# Altium schematic sheet DA1.SchDoc
size A0; SheetNumber: 1; SheetTotal: 1
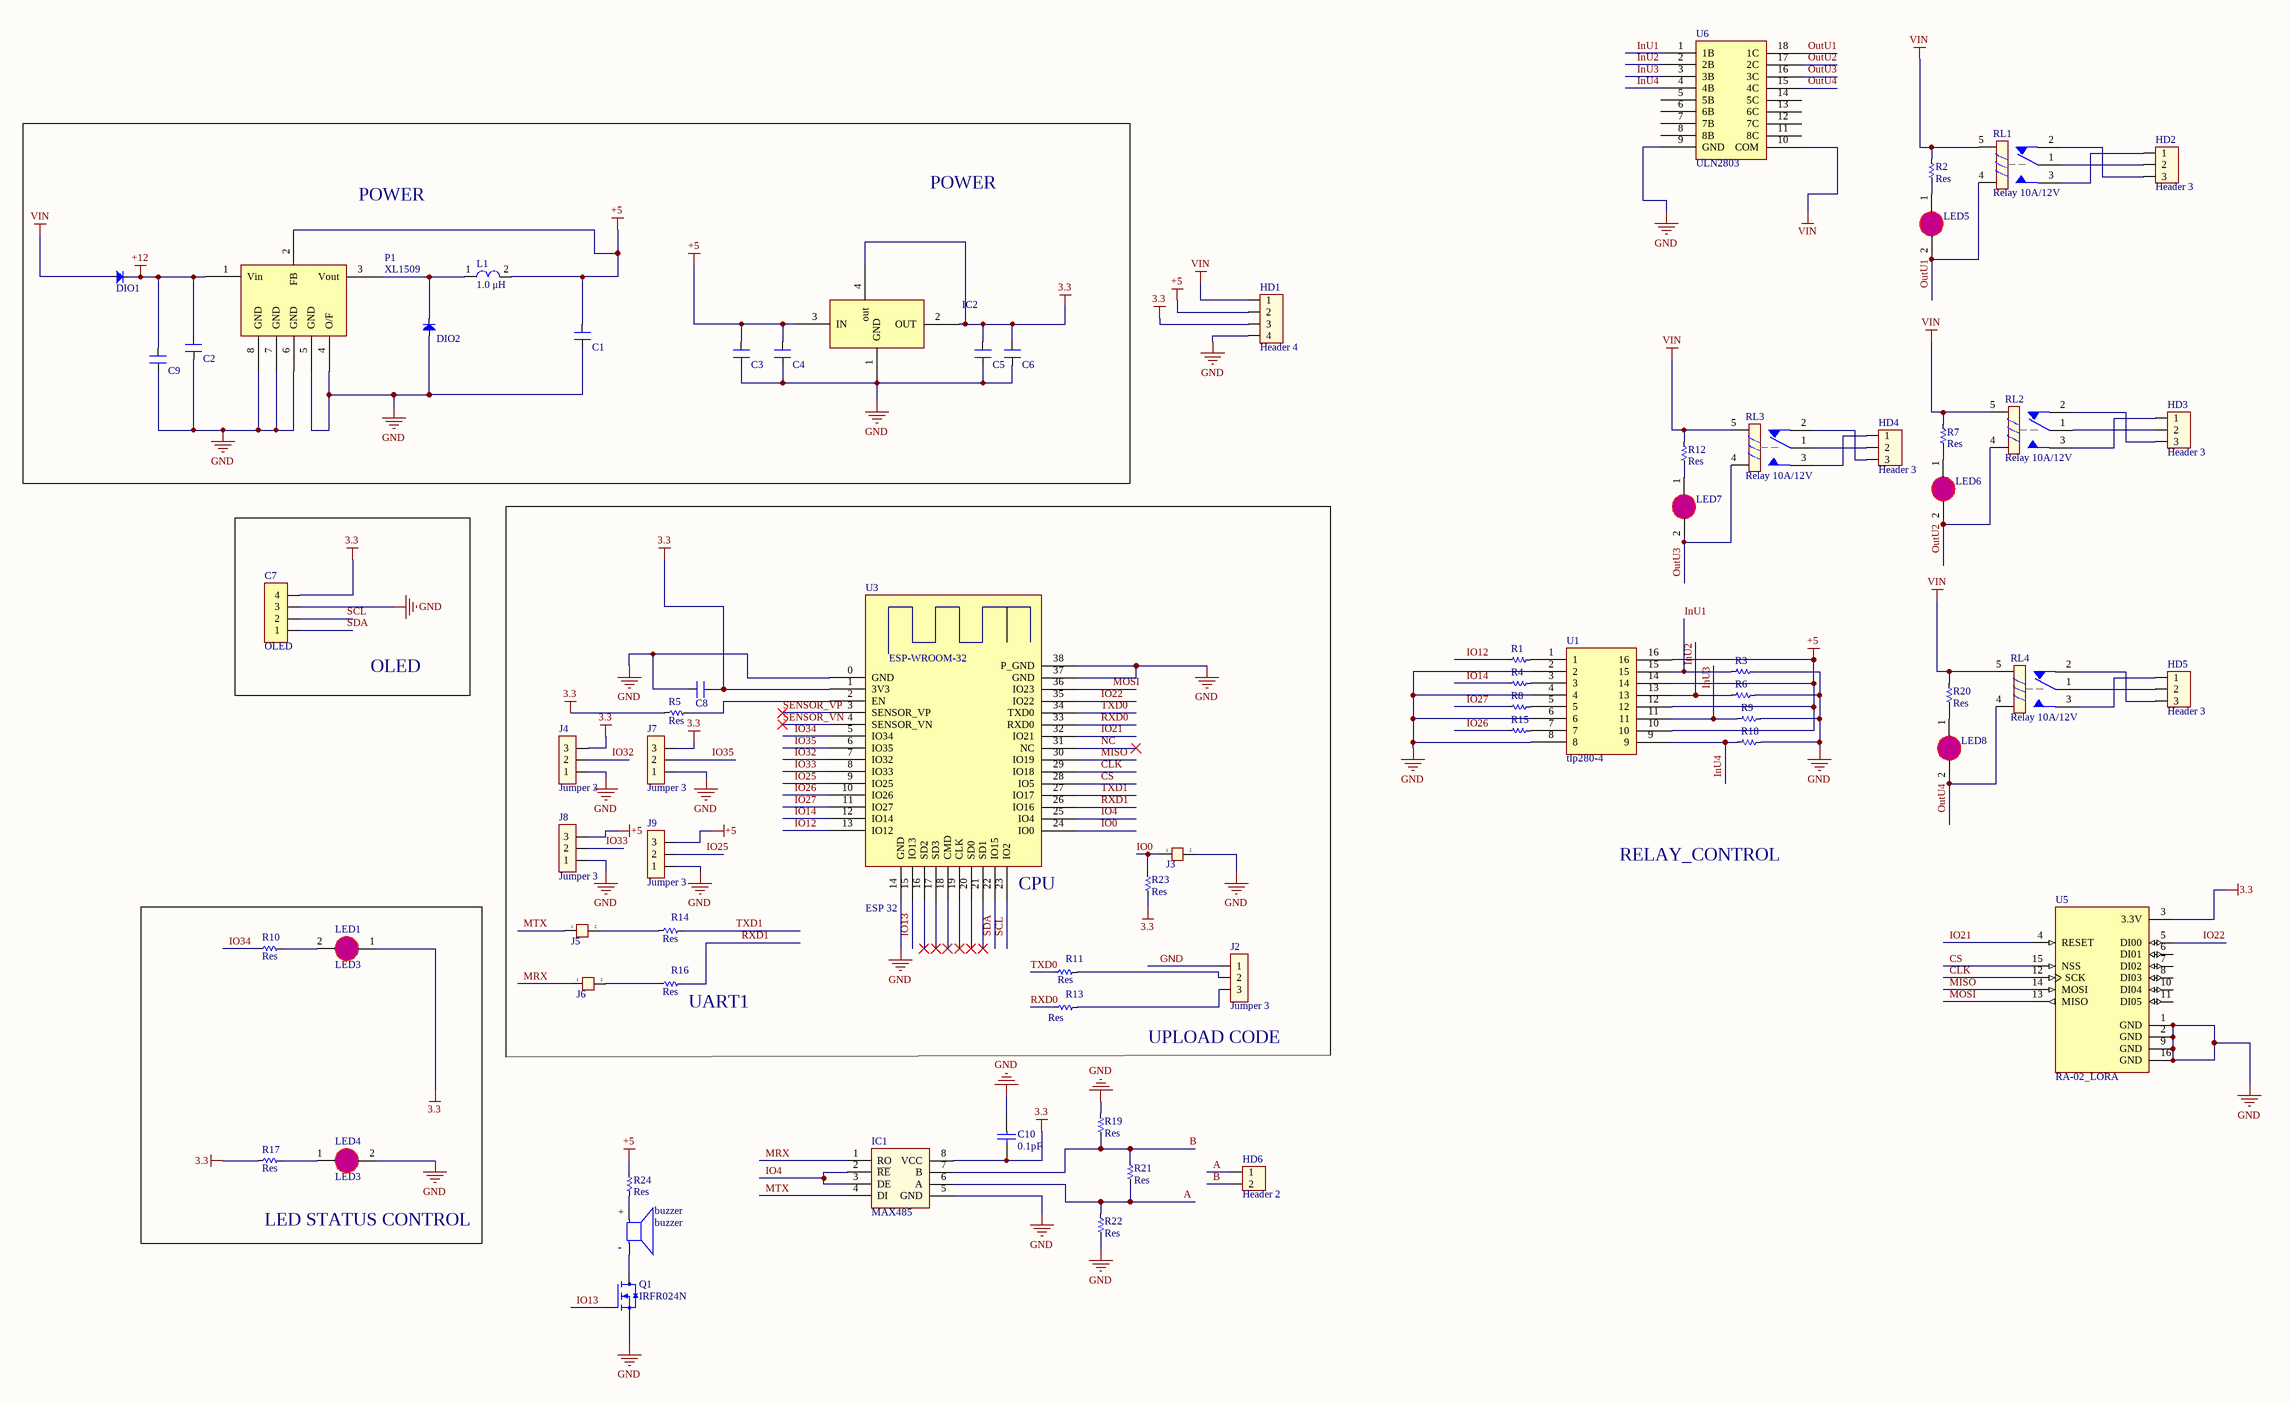
[diagram p0: DA1.SchDoc]

## Parts
buzzer  buzzer  [buzzer]
C1  CAPSMD  [1206]  (value not drawn)
C2  CAPSMD  [1206]  (value not drawn)
C3  CAPSMD  [SM-0805]  (value not drawn)
C4  CAPSMD  [SM-0805]  (value not drawn)
C5  CAPSMD  [SM-0805]  (value not drawn)
C6  CAPSMD  [SM-0805]  (value not drawn)
C7  OLED  [JP4-C1T]
C8  CAPSMD  [SM-0805]  (value not drawn)
C9  CAPSMD  [1206]  (value not drawn)
C10  value 0.1pF  [SMT0603]  (hidden comment: Cap)
DIO1  Diode SMD  [DIO-SMD-106]  (value not drawn)
DIO2  Diode SMD  [DIO-SMD-106]  (value not drawn)
HD1  Header 4  [HED4T]
HD2  Header 3  [HED3T]
HD3  Header 3  [HED3T]
HD4  Header 3  [HED3T]
HD5  Header 3  [HED3T]
HD6  Header 2  [HED2T]
IC1  MAX485  [SO-8]
IC2  ams1117  [SOT223-4N]  (value not drawn)
J2  Jumper 3  [JP3]
J3  Jumper 2  [J2]  (value not drawn)
J4  Jumper 3  [JP3]
J5  Jumper 2  [J2]  (value not drawn)
J6  Jumper 2  [J2]  (value not drawn)
J7  Jumper 3  [JP3]
J8  Jumper 3  [JP3]
J9  Jumper 3  [JP3]
L1  1.0 μH  [L-SMD-M-7.3x4.5]
LED1  LED3  [LED0805]
LED4  LED3  [LED0805]
LED5  (no value)  [LED0805]
LED6  (no value)  [LED0805]
LED7  (no value)  [LED0805]
LED8  (no value)  [LED0805]
P1  XL1509  [SOIC-8]
Q1  IRFR024N  [FET-SMD]
R1  Res  [RES-SMD-0805]  (value not drawn)
R2  Res  [RES-SMD-0805]
R3  Res  [RES-SMD-0805]  (value not drawn)
R4  Res  [RES-SMD-0805]  (value not drawn)
R5  Res  [RES-SMD-0805]
R6  Res  [RES-SMD-0805]  (value not drawn)
R7  Res  [RES-SMD-0805]
R8  Res  [RES-SMD-0805]  (value not drawn)
R9  Res  [RES-SMD-0805]  (value not drawn)
R10  Res  [RES-SMD-0805]
R11  Res  [RES-SMD-0805]
R12  Res  [RES-SMD-0805]
R13  Res  [RES-SMD-0805]
R14  Res  [RES-SMD-0805]
R15  Res  [RES-SMD-0805]  (value not drawn)
R16  Res  [RES-SMD-0805]
R17  Res  [RES-SMD-0805]
R18  Res  [RES-SMD-0805]  (value not drawn)
R19  Res  [RES-SMD-0805]
R20  Res  [RES-SMD-0805]
R21  Res  [RES-SMD-0805]
R22  Res  [RES-SMD-0805]
R23  Res  [RES-SMD-0805]
R24  Res  [RES-SMD-0805]
RL1  Relay 10A/12V  [RL_SPDT_10A]
RL2  Relay 10A/12V  [RL_SPDT_10A]
RL3  Relay 10A/12V  [RL_SPDT_10A]
RL4  Relay 10A/12V  [RL_SPDT_10A]
U1  tlp280-4  [SOP16]
U3  ESP 32  [ESP 32]
U5  RA-02_LORA  [MODULE_RA-02_LORA]
U6  ULN2803  [SOIC 18]

## Blocks framed on the sheet
OLED: C7
LED STATUS CONTROL: LED1 LED4 R10 R17

## Nets
3.3: C5.2 C6.2 C7.4 C8.2 C10.1 HD1.3 IC1.8(VCC) IC2.2(OUT) IC2.4(out) J4.3 J7.3 LED1.1(A) R5.2 R17.2 R23.2 U3.1(3V3) U5.3(3.3V)
+5: C1.2 C3.2 C4.2 HD1.2 IC2.3(IN) J8.3 J9.3 L1.2 P1.2(FB) R24.1 U1.10 U1.12 U1.14 U1.16
+12: C2.2 C9.2 DIO1.2(K) P1.1(Vin)
GND: C1.1 C2.1 C3.1 C4.1 C5.1 C6.1 C7.3 C8.1 C9.1 C10.2 DIO2.1(A) HD1.4 IC1.5(GND) IC2.1(GND) J2.1 J3.2 J4.1 J7.1 J8.1 J9.1 LED4.2(K) P1.4(O/F) P1.5(GND) P1.6(GND) P1.7(GND) P1.8(GND) Q1.3(S) R3.2 R6.2 R9.2 R18.2 R19.1 R22.2 U1.2 U1.4 U1.6 U1.8 U3.0(GND) U3.14(GND) U3.37(GND) U3.38(P_GND) U5.1(GND) U5.2(GND) U5.9(GND) U5.16(GND) U6.9(GND)
VIN: DIO1.1(A) HD1.1 R2.1 R7.1 R12.1 R20.1 RL1.5 RL2.5 RL3.5 RL4.5 U6.10(COM)
A: HD6.1 IC1.6(A) R21.2 R22.1
B: HD6.2 IC1.7(B) R19.2 R21.1
CLK: U3.29(IO18) U5.12(SCK)
CS: U3.28(IO5) U5.15(NSS)
InU1: R3.1 U1.15 U6.1(1B)
InU2: R6.1 U1.13 U6.2(2B)
InU3: R9.1 U1.11 U6.3(3B)
InU4: R18.1 U1.9 U6.4(4B)
IO0: J3.1 R23.1 U3.24(IO0)
IO4: IC1.2(~{RE}) IC1.3(DE) U3.25(IO4)
IO12: R1.1 U3.13(IO12)
IO13: Q1.1(G) U3.15(IO13)
IO14: R4.1 U3.12(IO14)
IO21: U3.32(IO21) U5.4(RESET)
IO22: U3.35(IO22) U5.5(DI00)
IO25: J9.2 U3.9(IO25)
IO26: R15.1 U3.10(IO26)
IO27: R8.1 U3.11(IO27)
IO32: J4.2 U3.7(IO32)
IO33: J8.2 U3.8(IO33)
IO34: R10.2 U3.5(IO34)
IO35: J7.2 U3.6(IO35)
MISO: U3.30(IO19) U5.14(MOSI)
MOSI: U3.36(IO23) U5.13(MISO)
MRX: IC1.1(RO) J6.1
MTX: IC1.4(DI) J5.1
NC: U3.31(NC)
OutU1: LED5.2(K) RL1.4 U6.18(1C)
OutU2: LED6.2(K) RL2.4 U6.17(2C)
OutU3: LED7.2(K) RL3.4 U6.16(3C)
OutU4: LED8.2(K) RL4.4 U6.15(4C)
RXD0: R13.2 U3.33(RXD0)
RXD1: R16.1 U3.26(IO16)
SCL: C7.2 U3.23(IO2)
SDA: C7.1 U3.22(IO15)
SENSOR_VN: U3.4(SENSOR_VN)
SENSOR_VP: U3.3(SENSOR_VP)
TXD0: R11.2 U3.34(TXD0)
TXD1: R14.1 U3.27(IO17)
Netbuzzer_N: buzzer.N(NEG) Q1.4(D)
Netbuzzer_P: buzzer.P(POS) R24.2
NetDIO2_2: DIO2.2(K) L1.1 P1.3(Vout)
NetHD2_1: HD2.1 RL1.3
NetHD2_2: HD2.2 RL1.1
NetHD2_3: HD2.3 RL1.2
NetHD3_1: HD3.1 RL2.3
NetHD3_2: HD3.2 RL2.1
NetHD3_3: HD3.3 RL2.2
NetHD4_1: HD4.1 RL3.3
NetHD4_2: HD4.2 RL3.1
NetHD4_3: HD4.3 RL3.2
NetHD5_1: HD5.1 RL4.3
NetHD5_2: HD5.2 RL4.1
NetHD5_3: HD5.3 RL4.2
NetJ2_2: J2.2 R11.1
NetJ2_3: J2.3 R13.1
NetJ5_2: J5.2 R14.2
NetJ6_2: J6.2 R16.2
NetLED1_2: LED1.2(K) R10.1
NetLED4_1: LED4.1(A) R17.1
NetLED5_1: LED5.1(A) R2.2
NetLED6_1: LED6.1(A) R7.2
NetLED7_1: LED7.1(A) R12.2
NetLED8_1: LED8.1(A) R20.2
NetR1_2: R1.2 U1.1
NetR4_2: R4.2 U1.3
NetR5_1: R5.1 U3.2(EN)
NetR8_2: R8.2 U1.5
NetR15_2: R15.2 U1.7

Not connected (* = marked no-connect by the designer): U3 16(SD2)* 17(SD3)* 18(CMD)* 19(CLK)* 20(SD0)* 21(SD1)*; U5 6(DI01) 7(DI02) 8(DI03) 10(DI04) 11(DI05); U6 5(5B) 6(6B) 7(7B) 8(8B) 11(8C) 12(7C) 13(6C) 14(5C)

## Notes on the sheet
- POWER
- (near U3) CPU
- RELAY_CONTROL
- (near R16) UART1
- (near J2) UPLOAD CODE
- (in symbol buzzer) +; -
- (in symbol ESP 32) ESP-WROOM-32

## Library data of the parts
buzzer = buzzer: ELECTRO-MECHANICAL AUDIO INDICATOR; MP: AI-1223-TWT-12V-R; MF: PUI Audio,; Availability: In Stock; Package: 2225 PUI Audio; Value: *; Price: None; Purchase-URL: https://pricing.snapeda.com/search/part/AI-1223-TWT-12V-R/?ref=eda
C1-C6 C8 C9 = CAPSMD: Cap SMD; Value: 103uf
C7 = JP4: WR-PHD 2.54 mm Angled Socket Header; Manufacturer: W¨¹rth Elektronik eiSos GmbH; partNo: 613004143121; ComponentLink1 Description: Manufacturer; ComponentLink2 Description: Datasheet; NoPins: 04; Created Date: 29 March 2013; ComponentLink1URL: http://www.we-online.com; ComponentLink2URL: http://katalog.we-online.de/em/datasheet/6130xx143121.pdf; Created by: Karrer Zheng
C10 = CAP-SM-0603-NC: CAP SM 0603 NC; Tolerance: ±10%
DIO1 DIO2 = Diode SMD: Default Diode; Code - JEDEC: DO-214-AB; Value: 1N5007; Published: 8-Jun-2000; Revision: July-2002: Re-released for DXP Platform.; Publisher: Altium Limited
HD1 = Hed4: Header 4 (Green); Value: Header 4
HD2-HD5 = Hed3: Header 3 (Green); Value: Header 3
HD6 = Hed2: Header 2 (Green); Value: Header 2
IC1 = MAX485: RS232 - RS485 (Same sn75176)
IC2 = ams1117: AMS 1117 : output 3.3,5,... (SOT223-4P)
J2 J4 J7-J9 = JP3: Value: J3
J3 J5 J6 = JP 2: Value: JP 2
L1 = L-SMD-1: partNo: 78477010; Manufacturer: Wurth Elektronik; Inductance: 1.0 μH; ComponentLink1Description: Manufacturer; ComponentLink1URL: http://www.we-online.de; Created by: Baojun Chen; Created Date: Nov.2015; ComponentLink2Description: Datasheet; ComponentLink2URL: http://katalog.we-online.de/pbs/datasheet/78477010.pdf
LED1 LED4-LED8 = LEDSMD: LED 3mm
Q1 = IRFR024N: N-Channel 55 V 17A (Tc) 45W (Tc) Surface Mount D-Pak; MF: Infineon Technologies; SnapEDA_Link: https://www.snapeda.com/parts/IRFR024N/Infineon%20Technologies/view-part/346952/?ref=snap; MP: IRFR024N; Availability: In Stock; Price: None; Check_prices: https://www.snapeda.com/parts/IRFR024N/Infineon%20Technologies/view-part/346952/?ref=eda; Value: *; Purchase-URL: https://pricing.snapeda.com/search/part/IRFR024N/?ref=eda; Package: TO-252 International Rectifier
R1-R24 = Res-SMD: Resistor; Manufacturer: Generic Components; Class: Passive; Published: 08/06/2000; Publisher: Altium Hobart Technology Centre
RL1-RL4 = Relay 1_1: Relay SPDT,10A - 12VDC 5 Pin; Value: Relay SPDT, 10A, 12V
U5 = RA-02_LORA: Ra-02 LoRa RF M5Stack Platform Evaluation Expansion Board; MF: AI-Thinker; Package: None; Check_prices: https://www.snapeda.com/parts/Ra-02%20LoRa/AI-Thinker/view-part/?ref=eda; Value: *; MP: Ra-02 LoRa; Availability: Not in stock; SnapEDA_Link: https://www.snapeda.com/parts/Ra-02%20LoRa/AI-Thinker/view-part/?ref=snap; Price: None
U6 = ULN2803_1: Darlington Transistor Arrays